# Altium schematic sheet WiFi小车.SchDoc
size A4
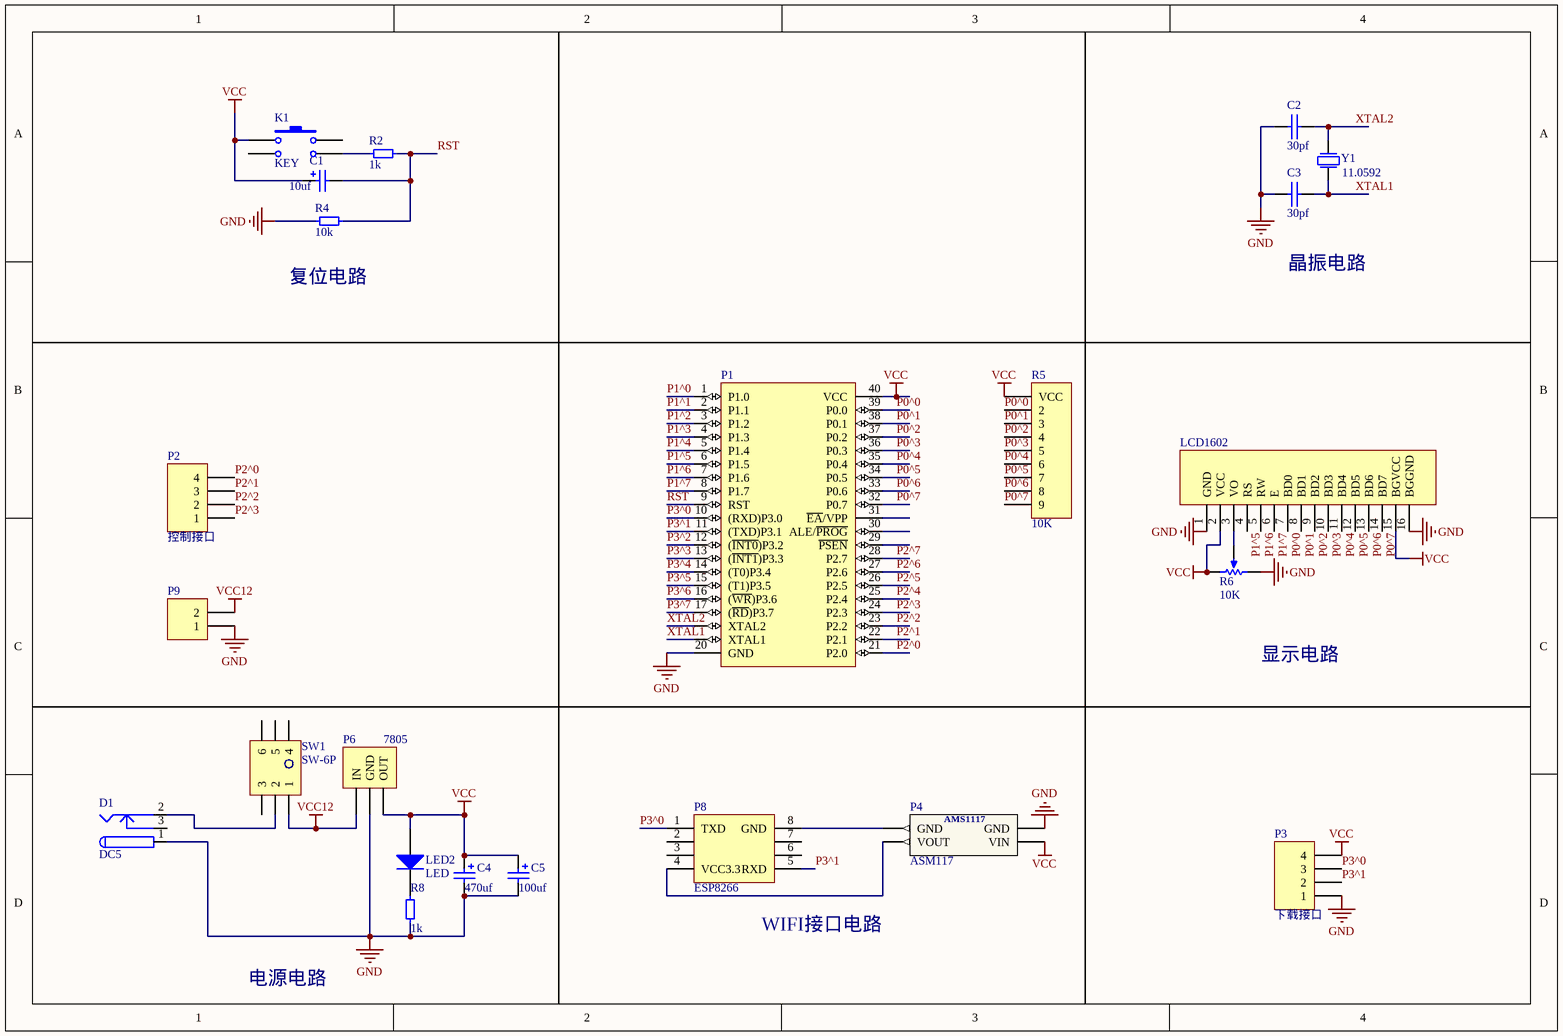
[diagram p0: WiFi小车.SchDoc]

## Parts
C1  10uf  [10uf]
C2  30pf  [C]
C3  30pf  [C]
C4  470uf  [C1000uf]
C5  100uf  [C1000uf]
D1  DC5  [DC5]
K1  KEY  [KEY]
LCD1602  LCD1602  [LCD1602]  (value not drawn)
LED2  LED  [LED]
P1  STC12C5A60S2  [STC89C52]  (value not drawn)
P2  控制接口  [4H]
P3  下载接口  [4H]
P4  ASM117  [3.3V稳压模块]
P6  7805  [3H]
P8  ESP8266  [NRF24L01]
P9  (no value)  [2H]
R2  1k  [R]
R4  10k  [R]
R5  10K  [R 10K*8]
R6  10K  [R 10K]
R8  1k  [R]
SW1  SW-6P  [DCSW]
Y1  11.0592  [crystal]

## Nets
GND: C2.2 C3.2 C4.2 C5.2 D1.1 LCD1602.1(GND) LCD1602.16(BGGND) P1.20(GND) P3.1 P4.1(GND) P6.2(GND) P9.1 R4.1 R6.1(TOP) R8.1
VCC: C1.1 C4.1 C5.1 K1.1 LCD1602.2(VCC) LCD1602.15(BGVCC) LED2.1(A) P1.40(VCC) P3.4 P4.2(VIN) P6.3(OUT) R5.1(VCC) R6.3(TAP)
VCC12: P6.1(IN) P9.2 SW1.1
P0^0: LCD1602.7(BD0) P1.39(P0.0) R5.2
P0^1: LCD1602.8(BD1) P1.38(P0.1) R5.3
P0^2: LCD1602.9(BD2) P1.37(P0.2) R5.4
P0^3: LCD1602.10(BD3) P1.36(P0.3) R5.5
P0^4: LCD1602.11(BD4) P1.35(P0.4) R5.6
P0^5: LCD1602.12(BD5) P1.34(P0.5) R5.7
P0^6: LCD1602.13(BD6) P1.33(P0.6) R5.8
P0^7: LCD1602.14(BD7) P1.32(P0.7) R5.9
P1^0: P1.1(P1.0)
P1^1: P1.2(P1.1)
P1^2: P1.3(P1.2)
P1^3: P1.4(P1.3)
P1^4: P1.5(P1.4)
P1^5: LCD1602.4(RS) P1.6(P1.5)
P1^6: LCD1602.5(RW) P1.7(P1.6)
P1^7: LCD1602.6(E) P1.8(P1.7)
P2^0: P1.21(P2.0) P2.4
P2^1: P1.22(P2.1) P2.3
P2^2: P1.23(P2.2) P2.2
P2^3: P1.24(P2.3) P2.1
P2^4: P1.25(P2.4)
P2^5: P1.26(P2.5)
P2^6: P1.27(P2.6)
P2^7: P1.28(P2.7)
P3^0: P1.10((RXD)P3.0) P3.3 P8.1(TXD)
P3^1: P1.11((TXD)P3.1) P3.2 P8.5(RXD)
P3^2: P1.12((~{INT0})P3.2)
P3^3: P1.13((~{INT1})P3.3)
P3^4: P1.14((T0)P3.4)
P3^5: P1.15((T1)P3.5)
P3^6: P1.16((~{WR})P3.6)
P3^7: P1.17((~{RD})P3.7)
RST: C1.2 P1.9(RST) R2.2 R4.2
XTAL1: C3.1 P1.19(XTAL1) Y1.2(P2)
XTAL2: C2.1 P1.18(XTAL2) Y1.1(P1)
NetD1_2: D1.2 SW1.2
NetK1_3: K1.3 R2.1
NetLCD1602_3: LCD1602.3(VO) R6.2(BOT)
NetLED2_2: LED2.2(K) R8.2
NetP4_3: P4.3(GND) P8.8(GND)
NetP4_4: P4.4(VOUT) P8.4(VCC3.3)

Not connected (* = marked no-connect by the designer): D1 3; K1 2 4; P1 29(~{PSEN}) 30(ALE/~{PROG}) 31(~{EA}/VPP); P8 2 3 6 7; SW1 3 4 5 6

## Notes on the sheet
- (near R4) 复位电路
- 晶振电路
- 显示电路
- 电源电路
- (near P8) WIFI接口电路
- (in symbol ASM117稳压模块) AMS1117

## Library data of the parts
C1 = C 10uf: 电解电容
C2 C3 = C: 贴片电容
C4 C5 = C1000uf: 电容
D1 = DC5: 电源接口
K1 = KEY: 复位按键
LCD1602 = LCD1602: 液晶显示屏
P1 = STC89C52: 单片机
P2 P3 = 4H
P4 = ASM117稳压模块: 稳压模块
P6 = 3H
P8 = nrf2401
P9 = 2H: 驱动接口
R2 R4 R8 = R: 电阻
R5 = R10K*8: 排阻
R6 = R10K: 可调电阻
SW1 = SW-6P: 电源开关
Y1 = crystal: 晶振